# Altium schematic sheet LED_Monitor_2.SchDoc
size Tabloid; SheetNumber: 3; SheetTotal: 8
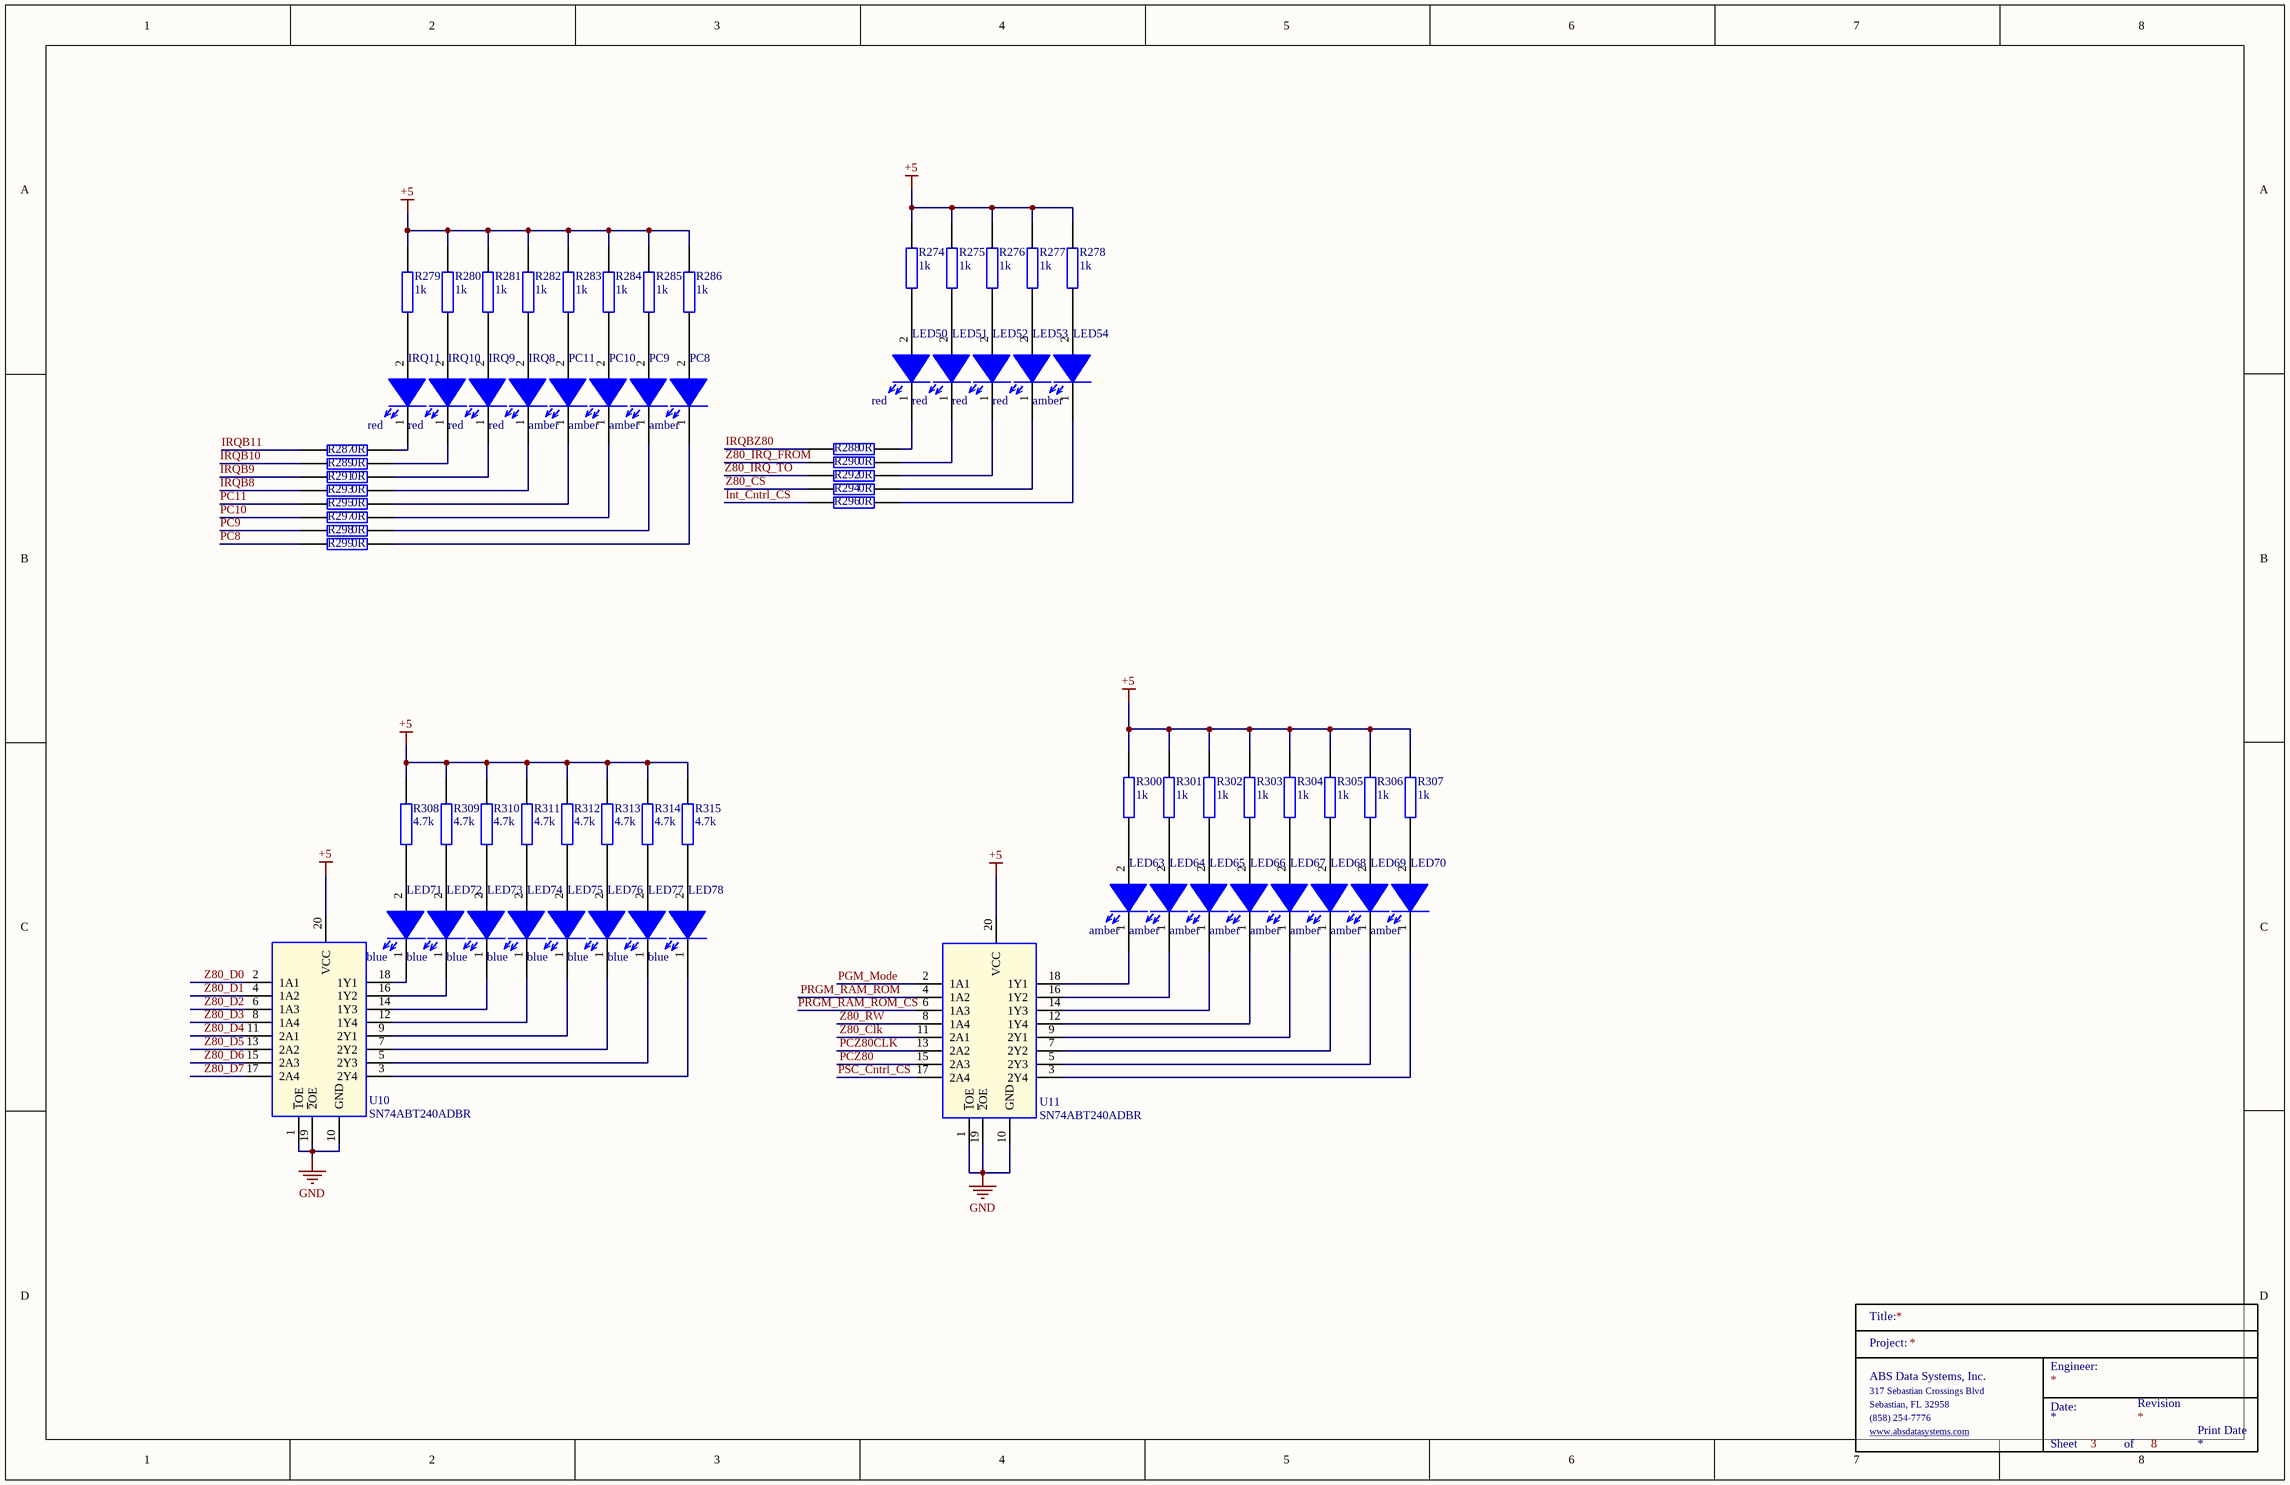
[diagram p0: LED_Monitor_2.SchDoc]

## Parts
IRQ8  red  [0603_Diode]
IRQ9  red  [0603_Diode]
IRQ10  red  [0603_Diode]
IRQ11  red  [0603_Diode]
LED50  red  [0603_Diode]
LED51  red  [0603_Diode]
LED52  red  [0603_Diode]
LED53  red  [0603_Diode]
LED54  amber  [0603_Diode]
LED63  amber  [0603_Diode]
LED64  amber  [0603_Diode]
LED65  amber  [0603_Diode]
LED66  amber  [0603_Diode]
LED67  amber  [0603_Diode]
LED68  amber  [0603_Diode]
LED69  amber  [0603_Diode]
LED70  amber  [0603_Diode]
LED71  blue  [0603_Diode]
LED72  blue  [0603_Diode]
LED73  blue  [0603_Diode]
LED74  blue  [0603_Diode]
LED75  blue  [0603_Diode]
LED76  blue  [0603_Diode]
LED77  blue  [0603_Diode]
LED78  blue  [0603_Diode]
PC8  amber  [0603_Diode]
PC9  amber  [0603_Diode]
PC10  amber  [0603_Diode]
PC11  amber  [0603_Diode]
R274  1k  [0603]
R275  1k  [0603]
R276  1k  [0603]
R277  1k  [0603]
R278  1k  [0603]
R279  1k  [0603]
R280  1k  [0603]
R281  1k  [0603]
R282  1k  [0603]
R283  1k  [0603]
R284  1k  [0603]
R285  1k  [0603]
R286  1k  [0603]
R287  0R  [0603]
R288  0R  [0603]
R289  0R  [0603]
R290  0R  [0603]
R291  0R  [0603]
R292  0R  [0603]
R293  0R  [0603]
R294  0R  [0603]
R295  0R  [0603]
R296  0R  [0603]
R297  0R  [0603]
R298  0R  [0603]
R299  0R  [0603]
R300  1k  [0603]
R301  1k  [0603]
R302  1k  [0603]
R303  1k  [0603]
R304  1k  [0603]
R305  1k  [0603]
R306  1k  [0603]
R307  1k  [0603]
R308  4.7k  [0603]
R309  4.7k  [0603]
R310  4.7k  [0603]
R311  4.7k  [0603]
R312  4.7k  [0603]
R313  4.7k  [0603]
R314  4.7k  [0603]
R315  4.7k  [0603]
TitleBlock_2  TitleBlock  (value not drawn)  (graphical)
U10  SN74ABT240ADBR  [SOP65P780X200-20N]
U11  SN74ABT240ADBR  [SOP65P780X200-20N]

## Nets
+5: R274.1 R275.1 R276.1 R277.1 R278.1 R279.1 R280.1 R281.1 R282.1 R283.1 R284.1 R285.1 R286.1 R300.1 R301.1 R302.1 R303.1 R304.1 R305.1 R306.1 R307.1 R308.1 R309.1 R310.1 R311.1 R312.1 R313.1 R314.1 R315.1 U10.20(VCC) U11.20(VCC)
GND: U10.1(~{1}OE) U10.10(GND) U10.19(~{2}OE) U11.1(~{1}OE) U11.10(GND) U11.19(~{2}OE)
Int_Cntrl_CS: R296.1
IRQB8: R293.1
IRQB9: R291.1
IRQB10: R289.1
IRQB11: R287.1
IRQBZ80: R288.1
PC8: R299.1
PC9: R298.1
PC10: R297.1
PC11: R295.1
PCZ80: U11.15(2A3)
PCZ80CLK: U11.13(2A2)
PGM_Mode: U11.2(1A1)
PRGM_RAM_ROM: U11.4(1A2)
PRGM_RAM_ROM_CS: U11.6(1A3)
PSC_Cntrl_CS: U11.17(2A4)
Z80_Clk: U11.11(2A1)
Z80_CS: R294.1
Z80_D0: U10.2(1A1)
Z80_D1: U10.4(1A2)
Z80_D2: U10.6(1A3)
Z80_D3: U10.8(1A4)
Z80_D4: U10.11(2A1)
Z80_D5: U10.13(2A2)
Z80_D6: U10.15(2A3)
Z80_D7: U10.17(2A4)
Z80_IRQ_FROM: R290.1
Z80_IRQ_TO: R292.1
Z80_RW: U11.8(1A4)
NetIRQ8_1: IRQ8.1(K) R293.2
NetIRQ8_2: IRQ8.2(A) R282.2
NetIRQ9_1: IRQ9.1(K) R291.2
NetIRQ9_2: IRQ9.2(A) R281.2
NetIRQ10_1: IRQ10.1(K) R289.2
NetIRQ10_2: IRQ10.2(A) R280.2
NetIRQ11_1: IRQ11.1(K) R287.2
NetIRQ11_2: IRQ11.2(A) R279.2
NetLED50_1: LED50.1(K) R288.2
NetLED50_2: LED50.2(A) R274.2
NetLED51_1: LED51.1(K) R290.2
NetLED51_2: LED51.2(A) R275.2
NetLED52_1: LED52.1(K) R292.2
NetLED52_2: LED52.2(A) R276.2
NetLED53_1: LED53.1(K) R294.2
NetLED53_2: LED53.2(A) R277.2
NetLED54_1: LED54.1(K) R296.2
NetLED54_2: LED54.2(A) R278.2
NetLED63_1: LED63.1(K) U11.18(1Y1)
NetLED63_2: LED63.2(A) R300.2
NetLED64_1: LED64.1(K) U11.16(1Y2)
NetLED64_2: LED64.2(A) R301.2
NetLED65_1: LED65.1(K) U11.14(1Y3)
NetLED65_2: LED65.2(A) R302.2
NetLED66_1: LED66.1(K) U11.12(1Y4)
NetLED66_2: LED66.2(A) R303.2
NetLED67_1: LED67.1(K) U11.9(2Y1)
NetLED67_2: LED67.2(A) R304.2
NetLED68_1: LED68.1(K) U11.7(2Y2)
NetLED68_2: LED68.2(A) R305.2
NetLED69_1: LED69.1(K) U11.5(2Y3)
NetLED69_2: LED69.2(A) R306.2
NetLED70_1: LED70.1(K) U11.3(2Y4)
NetLED70_2: LED70.2(A) R307.2
NetLED71_1: LED71.1(K) U10.18(1Y1)
NetLED71_2: LED71.2(A) R308.2
NetLED72_1: LED72.1(K) U10.16(1Y2)
NetLED72_2: LED72.2(A) R309.2
NetLED73_1: LED73.1(K) U10.14(1Y3)
NetLED73_2: LED73.2(A) R310.2
NetLED74_1: LED74.1(K) U10.12(1Y4)
NetLED74_2: LED74.2(A) R311.2
NetLED75_1: LED75.1(K) U10.9(2Y1)
NetLED75_2: LED75.2(A) R312.2
NetLED76_1: LED76.1(K) U10.7(2Y2)
NetLED76_2: LED76.2(A) R313.2
NetLED77_1: LED77.1(K) U10.5(2Y3)
NetLED77_2: LED77.2(A) R314.2
NetLED78_1: LED78.1(K) U10.3(2Y4)
NetLED78_2: LED78.2(A) R315.2
NetPC8_1: PC8.1(K) R299.2
NetPC8_2: PC8.2(A) R286.2
NetPC9_1: PC9.1(K) R298.2
NetPC9_2: PC9.2(A) R285.2
NetPC10_1: PC10.1(K) R297.2
NetPC10_2: PC10.2(A) R284.2
NetPC11_1: PC11.1(K) R295.2
NetPC11_2: PC11.2(A) R283.2

## Notes on the sheet
- Print Date
- (in symbol TitleBlock) Title:; Project:; Engineer:; ABS Data Systems, Inc.; 317 Sebastian Crossings Blvd; Sebastian, FL 32958; Date:; Revision; (858) 254-7776; www.absdatasystems.com; Sheet; of

## Library data of the parts
IRQ8-IRQ11 = 150060RS75000: Wurth Elektronik 0603 red; Manufacturer: Wurth Electronics; Manufacturer Part Number: 150060GS75000; Wavelength: 520nm; Viewing Angle: 140°; Lens Style: Clear,Rectangular; Luminous Intensity: 430mcd; Forward Current: 30mA; Forward Voltage: 3.2V; Test Current: 20mA; Supplier 1: Digi-Key; RoHS: Yes; Category: LEDs; Stock 1: 71509; Pricing 1: 1=0.14000, 50=0.13300, 100=0.11400, 500=0.09900 (USD); Mount: Surface Mount; Case/Package: 0603; Color: Green; Case Code (Metric): 1608; Case Code (Imperial): 0603; Min Operating Temperature: -40°C; Max Operating Temperature: 85°C; Package Quantity: 4000; Packaging: Tape and Reel; Dominant Wavelength: 520nm; Length: 1.6mm; Width: 0.8mm; Height: 0.7mm; REACH SVHC: Unknown; Lead Free: Lead Free; ComponentLink1URL: https://datasheet.ciiva.com/29562/150060gs75000-29562868.pdf?src-supplier=Digi-Key; ComponentLink1Description: https://datasheet.ciiva.com/29562/150060gs75000-29562868.pdf?src-supplier=Digi-Key; ComponentLink2URL: https://datasheet.ciiva.com/29279/759427-da-01-en-chipled-0603-w-kl-gruen-150060gs75000-29279201.pdf?src-supplier=Conrad; ComponentLink2Description: https://datasheet.ciiva.com/29279/759427-da-01-en-chipled-0603-w-kl-gruen-150060gs75000-29279201.pdf?src-supplier=Conrad; ComponentLink3URL: https://datasheet.ciiva.com/29562/150060gs75000-29562869.pdf?src-supplier=Digi-Key; ComponentLink3Description: https://datasheet.ciiva.com/29562/150060gs75000-29562869.pdf?src-supplier=Digi-Key; ComponentLink4URL: https://datasheet.ciiva.com/29562/150060gs75000-29562870.pdf?src-supplier=Digi-Key; ComponentLink4Description: https://datasheet.ciiva.com/29562/150060gs75000-29562870.pdf?src-supplier=Digi-Key
LED50-LED53 = 150060RS75000: Wurth Elektronik 0603 red; Manufacturer: Wurth Electronics; Manufacturer Part Number: 150060GS75000; Color: Green; Wavelength: 520nm; Viewing Angle: 140°; Lens Style: Clear,Rectangular; Luminous Intensity: 430mcd; Forward Current: 30mA; Forward Voltage: 3.2V; Test Current: 20mA; Supplier 1: Digi-Key; RoHS: Yes; Category: LEDs; Stock 1: 71509; Pricing 1: 1=0.14000, 50=0.13300, 100=0.11400, 500=0.09900 (USD); Mount: Surface Mount; Case/Package: 0603; Case Code (Metric): 1608; Case Code (Imperial): 0603; Min Operating Temperature: -40°C; Max Operating Temperature: 85°C; Package Quantity: 4000; Packaging: Tape and Reel; Dominant Wavelength: 520nm; Length: 1.6mm; Width: 0.8mm; Height: 0.7mm; REACH SVHC: Unknown; Lead Free: Lead Free; ComponentLink1URL: https://datasheet.ciiva.com/29562/150060gs75000-29562868.pdf?src-supplier=Digi-Key; ComponentLink1Description: https://datasheet.ciiva.com/29562/150060gs75000-29562868.pdf?src-supplier=Digi-Key; ComponentLink2URL: https://datasheet.ciiva.com/29279/759427-da-01-en-chipled-0603-w-kl-gruen-150060gs75000-29279201.pdf?src-supplier=Conrad; ComponentLink2Description: https://datasheet.ciiva.com/29279/759427-da-01-en-chipled-0603-w-kl-gruen-150060gs75000-29279201.pdf?src-supplier=Conrad; ComponentLink3URL: https://datasheet.ciiva.com/29562/150060gs75000-29562869.pdf?src-supplier=Digi-Key; ComponentLink3Description: https://datasheet.ciiva.com/29562/150060gs75000-29562869.pdf?src-supplier=Digi-Key; ComponentLink4URL: https://datasheet.ciiva.com/29562/150060gs75000-29562870.pdf?src-supplier=Digi-Key; ComponentLink4Description: https://datasheet.ciiva.com/29562/150060gs75000-29562870.pdf?src-supplier=Digi-Key
LED54 LED63-LED70 = 150060AS75000: Wurth Elektronik 0603 amber; Manufacturer: Wurth Electronics; Manufacturer Part Number: 150060GS75000; Color: Green; Wavelength: 520nm; Viewing Angle: 140°; Lens Style: Clear,Rectangular; Luminous Intensity: 430mcd; Forward Current: 30mA; Forward Voltage: 3.2V; Test Current: 20mA; Supplier 1: Digi-Key; RoHS: Yes; Category: LEDs; Stock 1: 71509; Pricing 1: 1=0.14000, 50=0.13300, 100=0.11400, 500=0.09900 (USD); Mount: Surface Mount; Case/Package: 0603; Case Code (Metric): 1608; Case Code (Imperial): 0603; Min Operating Temperature: -40°C; Max Operating Temperature: 85°C; Package Quantity: 4000; Packaging: Tape and Reel; Dominant Wavelength: 520nm; Length: 1.6mm; Width: 0.8mm; Height: 0.7mm; REACH SVHC: Unknown; Lead Free: Lead Free; ComponentLink1URL: https://datasheet.ciiva.com/29562/150060gs75000-29562868.pdf?src-supplier=Digi-Key; ComponentLink1Description: https://datasheet.ciiva.com/29562/150060gs75000-29562868.pdf?src-supplier=Digi-Key; ComponentLink2URL: https://datasheet.ciiva.com/29279/759427-da-01-en-chipled-0603-w-kl-gruen-150060gs75000-29279201.pdf?src-supplier=Conrad; ComponentLink2Description: https://datasheet.ciiva.com/29279/759427-da-01-en-chipled-0603-w-kl-gruen-150060gs75000-29279201.pdf?src-supplier=Conrad; ComponentLink3URL: https://datasheet.ciiva.com/29562/150060gs75000-29562869.pdf?src-supplier=Digi-Key; ComponentLink3Description: https://datasheet.ciiva.com/29562/150060gs75000-29562869.pdf?src-supplier=Digi-Key; ComponentLink4URL: https://datasheet.ciiva.com/29562/150060gs75000-29562870.pdf?src-supplier=Digi-Key; ComponentLink4Description: https://datasheet.ciiva.com/29562/150060gs75000-29562870.pdf?src-supplier=Digi-Key
LED71-LED78 = 150060BS75000: Wurth Elektronik 0603 blue; Manufacturer: Wurth Electronics; Manufacturer Part Number: 150060GS75000; Color: Green; Wavelength: 520nm; Viewing Angle: 140°; Lens Style: Clear,Rectangular; Luminous Intensity: 430mcd; Forward Current: 30mA; Forward Voltage: 3.2V; Test Current: 20mA; Supplier 1: Digi-Key; RoHS: Yes; Category: LEDs; Stock 1: 71509; Pricing 1: 1=0.14000, 50=0.13300, 100=0.11400, 500=0.09900 (USD); Mount: Surface Mount; Case/Package: 0603; Case Code (Metric): 1608; Case Code (Imperial): 0603; Min Operating Temperature: -40°C; Max Operating Temperature: 85°C; Package Quantity: 4000; Packaging: Tape and Reel; Dominant Wavelength: 520nm; Length: 1.6mm; Width: 0.8mm; Height: 0.7mm; REACH SVHC: Unknown; Lead Free: Lead Free; ComponentLink1URL: https://datasheet.ciiva.com/29562/150060gs75000-29562868.pdf?src-supplier=Digi-Key; ComponentLink1Description: https://datasheet.ciiva.com/29562/150060gs75000-29562868.pdf?src-supplier=Digi-Key; ComponentLink2URL: https://datasheet.ciiva.com/29279/759427-da-01-en-chipled-0603-w-kl-gruen-150060gs75000-29279201.pdf?src-supplier=Conrad; ComponentLink2Description: https://datasheet.ciiva.com/29279/759427-da-01-en-chipled-0603-w-kl-gruen-150060gs75000-29279201.pdf?src-supplier=Conrad; ComponentLink3URL: https://datasheet.ciiva.com/29562/150060gs75000-29562869.pdf?src-supplier=Digi-Key; ComponentLink3Description: https://datasheet.ciiva.com/29562/150060gs75000-29562869.pdf?src-supplier=Digi-Key; ComponentLink4URL: https://datasheet.ciiva.com/29562/150060gs75000-29562870.pdf?src-supplier=Digi-Key; ComponentLink4Description: https://datasheet.ciiva.com/29562/150060gs75000-29562870.pdf?src-supplier=Digi-Key
PC8-PC11 = 150060AS75000: Wurth Elektronik 0603 amber; Manufacturer: Wurth Electronics; Manufacturer Part Number: 150060GS75000; Wavelength: 520nm; Viewing Angle: 140°; Lens Style: Clear,Rectangular; Luminous Intensity: 430mcd; Forward Current: 30mA; Forward Voltage: 3.2V; Test Current: 20mA; Supplier 1: Digi-Key; RoHS: Yes; Category: LEDs; Stock 1: 71509; Pricing 1: 1=0.14000, 50=0.13300, 100=0.11400, 500=0.09900 (USD); Mount: Surface Mount; Case/Package: 0603; Color: Green; Case Code (Metric): 1608; Case Code (Imperial): 0603; Min Operating Temperature: -40°C; Max Operating Temperature: 85°C; Package Quantity: 4000; Packaging: Tape and Reel; Dominant Wavelength: 520nm; Length: 1.6mm; Width: 0.8mm; Height: 0.7mm; REACH SVHC: Unknown; Lead Free: Lead Free; ComponentLink1URL: https://datasheet.ciiva.com/29562/150060gs75000-29562868.pdf?src-supplier=Digi-Key; ComponentLink1Description: https://datasheet.ciiva.com/29562/150060gs75000-29562868.pdf?src-supplier=Digi-Key; ComponentLink2URL: https://datasheet.ciiva.com/29279/759427-da-01-en-chipled-0603-w-kl-gruen-150060gs75000-29279201.pdf?src-supplier=Conrad; ComponentLink2Description: https://datasheet.ciiva.com/29279/759427-da-01-en-chipled-0603-w-kl-gruen-150060gs75000-29279201.pdf?src-supplier=Conrad; ComponentLink3URL: https://datasheet.ciiva.com/29562/150060gs75000-29562869.pdf?src-supplier=Digi-Key; ComponentLink3Description: https://datasheet.ciiva.com/29562/150060gs75000-29562869.pdf?src-supplier=Digi-Key; ComponentLink4URL: https://datasheet.ciiva.com/29562/150060gs75000-29562870.pdf?src-supplier=Digi-Key; ComponentLink4Description: https://datasheet.ciiva.com/29562/150060gs75000-29562870.pdf?src-supplier=Digi-Key
R274-R286 R300-R307 = AC0603FR-7W1KL_1: YAGEO 0603 1k ohm; Manufacturer_Name: KEMET; Manufacturer_Part_Number: RC0603JR-070RL; Geometry.Height: 0.55mm; Mouser Part Number: 603-RC0603JR-070RL; Mouser Price/Stock: https://www.mouser.co.uk/ProductDetail/YAGEO/RC0603JR-070RL?qs=2cAdsCoAWRGWyPcuXgGiXQ%3D%3D; Datasheet Link: https://datasheet.datasheetarchive.com/originals/distributors/Datasheets_SAMA/902f9e387b938f871d31120f5fc1d65e.pdf
R287-R299 = RC0603JR-070RL: YAGEO 0603 0 ohm; Manufacturer_Name: KEMET; Geometry.Height: 0.55mm; Mouser Part Number: 603-RC0603JR-070RL; Mouser Price/Stock: https://www.mouser.co.uk/ProductDetail/YAGEO/RC0603JR-070RL?qs=2cAdsCoAWRGWyPcuXgGiXQ%3D%3D; Manufacturer_Part_Number: RC0603JR-070RL; Datasheet Link: https://datasheet.datasheetarchive.com/originals/distributors/Datasheets_SAMA/902f9e387b938f871d31120f5fc1d65e.pdf
R308-R315 = RC0603FR-104K7L: YAGEO 0603 4.7k; Manufacturer_Name: KEMET; Manufacturer_Part_Number: RC0603JR-070RL; Geometry.Height: 0.55mm; Mouser Part Number: 603-RC0603JR-070RL; Mouser Price/Stock: https://www.mouser.co.uk/ProductDetail/YAGEO/RC0603JR-070RL?qs=2cAdsCoAWRGWyPcuXgGiXQ%3D%3D; Datasheet Link: https://datasheet.datasheetarchive.com/originals/distributors/Datasheets_SAMA/902f9e387b938f871d31120f5fc1d65e.pdf
U10 U11 = SN74ABT240ADBR: Octal Buffers/Drivers With 3-State Outputs; Manufacturer_Name: Texas Instruments; Geometry.Height: 2mm; Mouser Part Number: 595-SN74ABT240ADBR; Mouser Price/Stock: https://www.mouser.co.uk/ProductDetail/Texas-Instruments/SN74ABT240ADBR?qs=JHHQeKcAU3Dt82k%252BVyiYdw%3D%3D; Manufacturer_Part_Number: SN74ABT240ADBR; Datasheet Link: http://www.ti.com/lit/gpn/sn74abt240a